# Altium project 05021002.PrjPcb
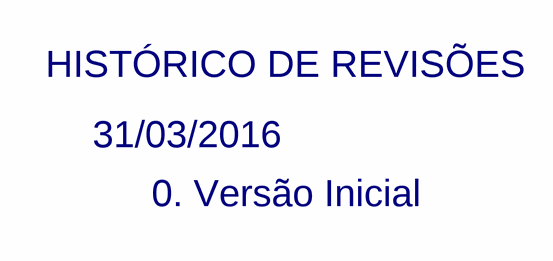
[diagram p0: 05021002_RevisionHistory.SchDoc]
8 sheets, 69 parts. Net scope: global (net labels, ports and power ports of the same name join across sheets).
Board file: 05021002.PcbDoc
Sheets:
  05021002_RevisionHistory.SchDoc
  05021002_Input's.SchDoc
  05021002_GPIO's.SchDoc
  05021002_Serial.SchDoc
  05021002_Analog's.SchDoc
  05021002_PWM - Buzzer and Led.SchDoc
  05021002_Accelerometer.SchDoc
  05021002_7-Segment Display.SchDoc

## Sheet 05021002_RevisionHistory.SchDoc: Ipê Board
size A4; Organization: Cerebra SC; Address1: R. Coriolano José Gilbertone; Address2: Jd. Paulista; Address3: n° 703; Address4: São Carlos - Brasil; DocumentNumber: 1; Revision: A; SheetNumber: 1; SheetTotal: 8

### Notes on the sheet
- HISTÓRICO DE REVISÕES
- 31/03/2016
- 0. Versão Inicial
- Title
- Size:
- Date:
- A4
- Number:
- Time:
- Revision:
- Sheet
- of
- File:

## Sheet 05021002_Input's.SchDoc: Ipê Board
size A4; Organization: Cerebra SC; Address1: R. Coriolano José Gilbertone; Address2: Jd. Paulista; Address3: n° 703; Address4: São Carlos - Brasil; DocumentNumber: 2; Revision: A; SheetNumber: 2; SheetTotal: 8
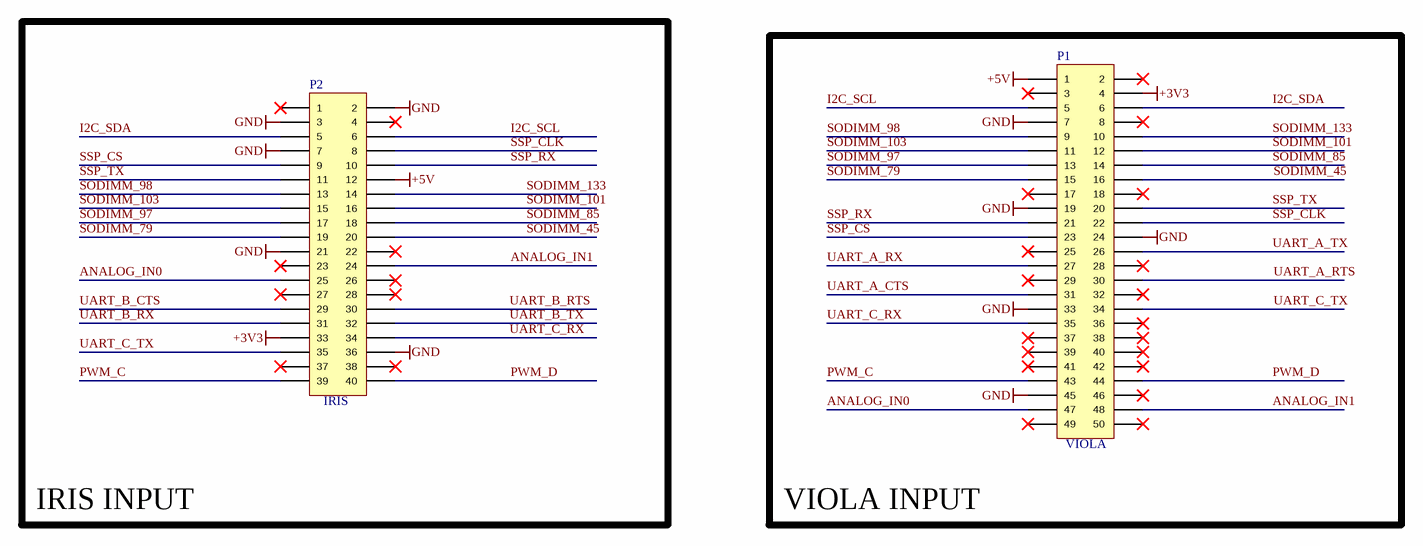
[diagram p1: 05021002_Input's.SchDoc]

### Parts
P1  VIOLA  [HDR2X25]
P2  IRIS  [HDR2X20]

### Blocks framed on the sheet
IRIS INPUT: P2
VIOLA INPUT: P1

### Nets
+3V3: P1.4 P2.33
+5V: P1.1 P2.12
GND: P1.7 P1.19 P1.24 P1.33 P1.45 P2.2 P2.3 P2.7 P2.21 P2.36
ANALOG_IN0: P1.47 P2.25
ANALOG_IN1: P1.48 P2.24
I2C_SCL: P1.5 P2.6
I2C_SDA: P1.6 P2.5
PWM_C: P1.43 P2.39
PWM_D: P1.44 P2.40
SODIMM_45: P1.16 P2.20
SODIMM_79: P1.15 P2.19
SODIMM_85: P1.14 P2.18
SODIMM_97: P1.13 P2.17
SODIMM_98: P1.9 P2.13
SODIMM_101: P1.12 P2.16
SODIMM_103: P1.11 P2.15
SODIMM_133: P1.10 P2.14
SSP_CLK: P1.22 P2.8
SSP_CS: P1.23 P2.9
SSP_RX: P1.21 P2.10
SSP_TX: P1.20 P2.11
UART_A_CTS: P1.31 P2.29  [also labelled UART_B_CTS]
UART_A_RTS: P1.30 P2.30  [also labelled UART_B_RTS]
UART_A_RX: P1.27 P2.31  [also labelled UART_B_RX]
UART_A_TX: P1.26 P2.32  [also labelled UART_B_TX]
UART_C_RX: P1.35 P2.34
UART_C_TX: P1.34 P2.35

Not connected (* = marked no-connect by the designer): P1 2* 3* 8* 17* 18* 25* 28* 29* 32* 36* 37* 38* 39* 40* 41* 42* 46* 49* 50*; P2 1* 4* 22* 23* 26* 27* 28* 37* 38*

### Notes on the sheet
- Title
- Size:
- Date:
- A4
- Number:
- Time:
- Revision:
- Sheet
- of
- File:

### Library data of the parts
P1 = Header 25X2: Header, 25-Pin, Dual row; LatestRevisionDate: 17-Jul-2002; LatestRevisionNote: Re-released for DXP Platform.; Publisher: Altium Limited
P2 = Header 20X2: Header, 20-Pin, Dual row; LatestRevisionDate: 17-Jul-2002; LatestRevisionNote: Re-released for DXP Platform.; Publisher: Altium Limited

## Sheet 05021002_GPIO's.SchDoc: Ipê Board
size A4; Organization: Cerebra SC; Address1: R. Coriolano José Gilbertone; Address2: Jd. Paulista; Address3: n° 703; Address4: São Carlos - Brasil; DocumentNumber: 3; Revision: A; SheetNumber: 3; SheetTotal: 8
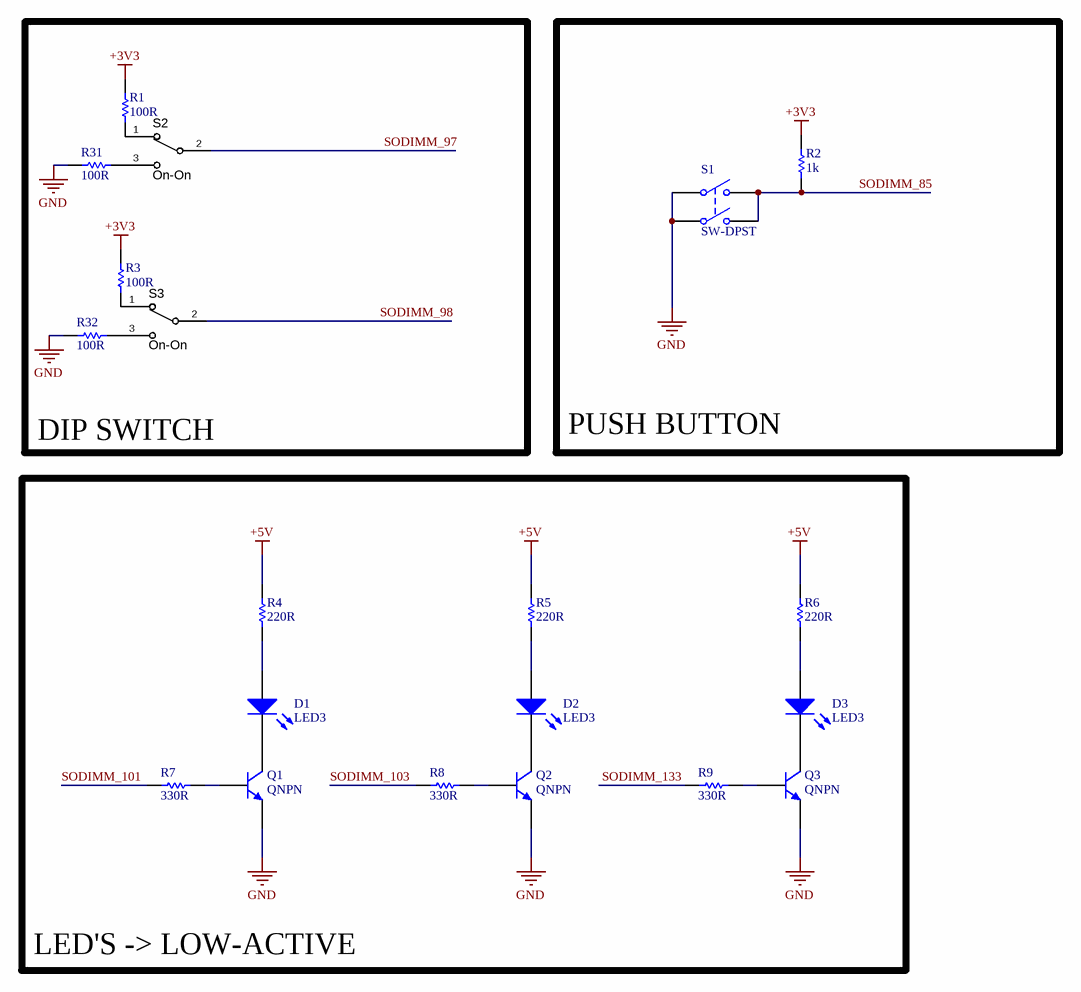
[diagram p2: 05021002_GPIO's.SchDoc]

### Parts
D1  LED3  [LED-0805-K]
D2  LED3  [LED-0805-K]
D3  LED3  [LED-0805-K]
Q1  QNPN  [SOT-23]
Q2  QNPN  [SOT-23]
Q3  QNPN  [SOT-23]
R1  100R  [0805]
R2  1k  [0805]
R3  100R  [0805]
R4  220R  [0805]
R5  220R  [0805]
R6  220R  [0805]
R7  330R  [0805]
R8  330R  [0805]
R9  330R  [0805]
R31  100R  [0805]
R32  100R  [0805]
S1  SW-DPST  [430182080816]
S2  ON-ON  [SWITCH_SPDT_SLIDER]
S3  ON-ON  [SWITCH_SPDT_SLIDER]

### Blocks framed on the sheet
DIP SWITCH: R1 R3 R31 R32 S2 S3
PUSH BUTTON: R2 S1
LED'S -> LOW-ACTIVE: D1-D3 Q1-Q3 R4-R9

### Nets
+3V3: R1.2 R2.2 R3.2
+5V: R4.2 R5.2 R6.2
GND: Q1.3(E) Q2.3(E) Q3.3(E) R31.2 R32.2 S1.1(COMMON1) S1.3(COMMON2)
SODIMM_85: R2.1 S1.2(NO1) S1.4(NO2)
SODIMM_97: S2.2
SODIMM_98: S3.2
SODIMM_101: R7.1
SODIMM_103: R8.1
SODIMM_133: R9.1
NetD1_1: D1.1(A) R4.1
NetD1_2: D1.2(K) Q1.1(C)
NetD2_1: D2.1(A) R5.1
NetD2_2: D2.2(K) Q2.1(C)
NetD3_1: D3.1(A) R6.1
NetD3_2: D3.2(K) Q3.1(C)
NetQ1_2: Q1.2(B) R7.2
NetQ2_2: Q2.2(B) R8.2
NetQ3_2: Q3.2(B) R9.2
NetR1_1: R1.1 S2.1
NetR3_1: R3.1 S3.1
NetR31_1: R31.1 S2.3
NetR32_1: R32.1 S3.3

### Notes on the sheet
- Title
- Size:
- Date:
- A4
- Number:
- Time:
- Revision:
- Sheet
- of
- File:

### Library data of the parts
D1-D3 = LED3: Typical BLUE SiC LED; pin to pad: 1>A 2>K; Part Number 1: LG R971-KN-1; Manufacturer 1: OSRAM Opto Semiconductors Inc.; Published: 8-Jun-2000; LatestRevisionDate: 17-Dec-2003; LatestRevisionNote: PCB Footprint replaced.; DatasheetVersion: 16-Apr-2002; PackageVersion: 16-Apr-2002; PackageReference: 3.5X2.8X1.9; Publisher: Altium Limited; PackageDescription: SM LED; 2 C-Bend Leads; Body 3.5 x 2.8 x 1.9 mm, inc leads (LxWxH typ)
Q1-Q3 = QNPN: NPN Bipolar Transistor; Part Number 1: MMBT2222A-7-F; Manufacturer 1: Diodes Incorporated; Published: 8-Jun-2000; LatestRevisionDate: 29-May-2009; LatestRevisionNote: IPC-7351 Footprint Added.; PackageVersion: Aug-1999; PackageReference: SOT-23B; Publisher: Altium Limited; PackageDescription: 3-Pin SOT-23 Package 0.95 mm Pitch, 2.4 mm Lead Span
R1 R3 R31 R32 = resistor_gen: Part Number 1: RMCF0805JT100R; Manufacturer 1: Stackpole Electronics Inc.; Value: 100R
R2 = resistor_gen: Part Number 1: RC0805JR-071KL; Manufacturer 1: Yageo; Value: 1k
R4-R6 = resistor_gen: Part Number 1: RMCF0805JT220R; Manufacturer 1: Stackpole Electronics Inc.; Value: 220R
R7-R9 = resistor_gen: Part Number 1: RMCF0805JT330R; Manufacturer 1: Stackpole Electronics Inc.; Value: 330R
S1 = SW-DPST: Double-Pole, Single-Throw Switch; Manufacturer 1: Wurth Electronics Inc; Published: 24-Mar-1999; LatestRevisionDate: 17-Jul-2002; LatestRevisionNote: Re-released for DXP Platform.; PackageReference: DPST-4; Publisher: Altium Limited; PackageDescription: Switch; 4 Leads; Part Number 1: 430182080816
S2 S3 = SW_THD_SPDT_On-On: Switch THD vertical toggle SPDT; Manufacturer 1: TE Connectivity; Part Number 1: SLS121PC04; Contact Rating @ Voltage: 0.25A @ 125VAC; SCDType: spec; Circuit: SPDT; Mounting Type: PCB mount; Supplier 1: Digi-Key; Supplier Part Number 1: 450-1598-ND; Switch Function: On-On

## Sheet 05021002_Serial.SchDoc: Ipê Board
size A4; Organization: Cerebra SC; Address1: R. Coriolano José Gilbertone; Address2: Jd. Paulista; Address3: n° 703; Address4: São Carlos - Brasil; DocumentNumber: 4; Revision: A; SheetNumber: 4; SheetTotal: 8
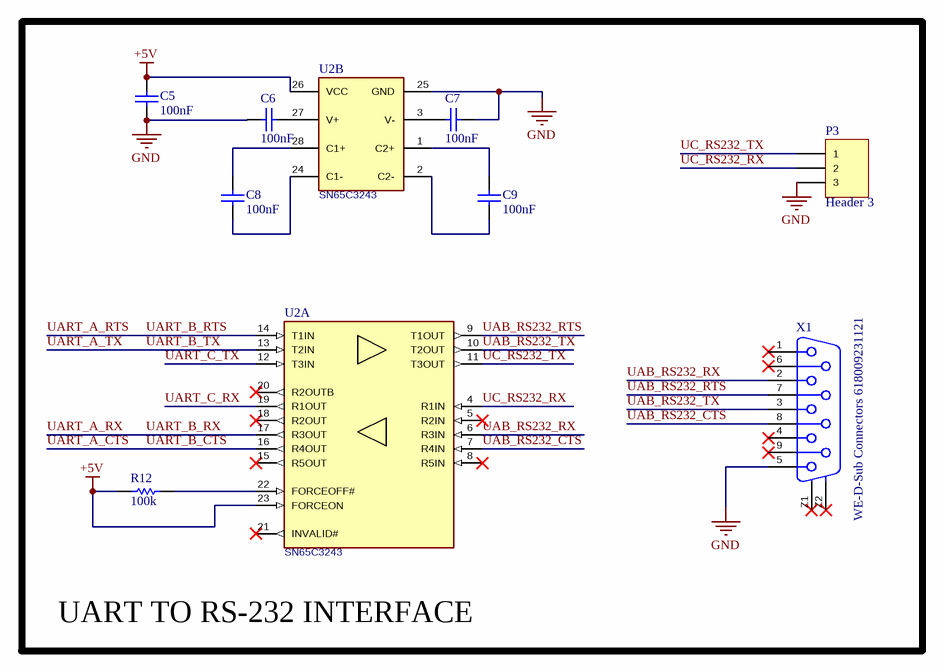
[diagram p3: 05021002_Serial.SchDoc]

### Parts
C5  100nF  [CAPC2012X135N]
C6  100nF  [CAPC2012X135N]
C7  100nF  [CAPC2012X135N]
C8  100nF  [CAPC2012X135N]
C9  100nF  [CAPC2012X135N]
P3  Header 3  [HDR1X3]
R12  100k  [0805]
U2  SN65C3243  [SOP65P780X200-28N]  (parts A,B of 2)
X1  WE-D-Sub Connectors 618009231121  [618009231121]

### Blocks framed on the sheet
UART TO RS-232 INTERFACE: C5-C9 P3 R12 U2 X1

### Nets
+5V: C5.2 R12.1 U2.23(FORCEON) U2.26(VCC)
GND: C5.1 C6.1 C7.2 P3.3 U2.25(GND) X1.5
UAB_RS232_CTS: U2.7(R4IN) X1.8
UAB_RS232_RTS: U2.9(T1OUT) X1.7
UAB_RS232_RX: U2.6(R3IN) X1.2
UAB_RS232_TX: U2.10(T2OUT) X1.3
UART_A_CTS: U2.16(R4OUT)  [also labelled UART_B_CTS]
UART_A_RTS: U2.14(T1IN)  [also labelled UART_B_RTS]
UART_A_RX: U2.17(R3OUT)  [also labelled UART_B_RX]
UART_A_TX: U2.13(T2IN)  [also labelled UART_B_TX]
UART_C_RX: U2.19(R1OUT)
UART_C_TX: U2.12(T3IN)
UC_RS232_RX: P3.2 U2.4(R1IN)
UC_RS232_TX: P3.1 U2.11(T3OUT)
NetC6_2: C6.2 U2.27(V+)
NetC7_1: C7.1 U2.3(V-)
NetC8_1: C8.1 U2.24(C1-)
NetC8_2: C8.2 U2.28(C1+)
NetC9_1: C9.1 U2.2(C2-)
NetC9_2: C9.2 U2.1(C2+)
NetR12_2: R12.2 U2.22(FORCEOFF#)

Not connected (* = marked no-connect by the designer): U2 5(R2IN)* 8(R5IN)* 15(R5OUT)* 18(R2OUT)* 20(R2OUTB)* 21(INVALID#)*; X1 1* 4* 6* 9* Z1(GND)* Z2(GND)*

### Notes on the sheet
- Title
- Size:
- Date:
- A4
- Number:
- Time:
- Revision:
- Sheet
- of
- File:

### Library data of the parts
C5-C9 = capacitor_gen: Generic Capacitor; Part Number 1: 885012207016; Manufacturer 1: Wurth Electronics Inc; Value: 100nF
P3 = Header 3: Header, 3-Pin; LatestRevisionDate: 17-Jul-2002; LatestRevisionNote: Re-released for DXP Platform.; Publisher: Altium Limited
R12 = resistor_gen: Part Number 1: RC0805JR-07100KL; Manufacturer 1: Yageo; Value: 100k
U2 = IC-TI-SN65C3243: RS-232 Serial Transceiver; Manufacturer 1: Texas Instruments; Part Number 1: SN65C3243
X1 = WE-D-Sub Connectors 618009231121: WR-DSUB Female Angled PCB Connector; Manufacturer 1: Wurth Elektronik; ComponentLink1 Description: Manufacturer; ComponentLink2 Description: Datasheet; NoPins: 9; ComponentLink1URL: http://www.we-online.de; ComponentLink2URL: http://katalog.we-online.de/em/datasheet/6180xx231121.pdf; Created by: Karrer Zheng; Created Date: 10/16/2014; Part Number 1: 618009231121

## Sheet 05021002_Analog's.SchDoc: Ipê Board
size A4; Organization: Cerebra SC; Address1: R. Coriolano José Gilbertone; Address2: Jd. Paulista; Address3: n° 703; Address4: São Carlos - Brasil; DocumentNumber: 5; Revision: A; SheetNumber: 5; SheetTotal: 8
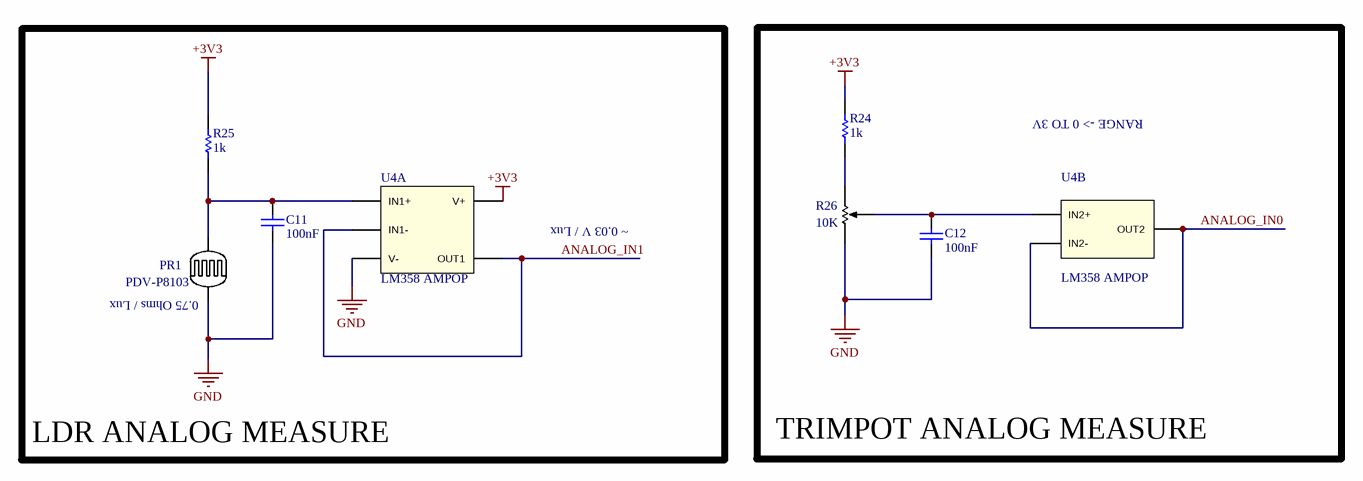
[diagram p4: 05021002_Analog's.SchDoc]

### Parts
C11  100nF  [CAPC2012X135N]
C12  100nF  [CAPC2012X135N]
PR1  PDV-P8103  [PDV-P8103]
R24  1k  [0805]
R25  1k  [0805]
R26  10K  [TC33X-2-103E]
U4  LM358 AMPOP  [SOIC 8]  (parts A,B of 2)

### Blocks framed on the sheet
LDR ANALOG MEASURE: C11 PR1 R25 U4
TRIMPOT ANALOG MEASURE: C12 R24 R26 U4

### Nets
+3V3: R24.2 R25.2 U4.8(V+)
GND: C11.1 C12.1 PR1.2 R26.1(CCW) U4.4(V-)
ANALOG_IN0: U4.6(IN2-) U4.7(OUT2)
ANALOG_IN1: U4.1(OUT1) U4.2(IN1-)
NetC11_2: C11.2 PR1.1 R25.1 U4.3(IN1+)
NetC12_2: C12.2 R26.2(WIPER) U4.5(IN2+)
NetR24_1: R24.1 R26.3(CW)

### Notes on the sheet
- RANGE -> 0 TO 3V
- ~ 0.03 V / Lux
- (near PR1) 0.75 Ohms / Lux
- Title
- Size:
- Date:
- A4
- Number:
- Time:
- Revision:
- Sheet
- of
- File:

### Library data of the parts
C11 C12 = capacitor_gen: as C5 on sheet 05021002_Serial; Value: 100nF
PR1 = PhotoResistor PDV-P8103: Photoconductive photocells designed to sense light from 400 to 700 nm; Manufacturer 1: Luna Optoelectronics; Part Number 1: PDV-P8103
R24 R25 = resistor_gen: as R2 on sheet 05021002_GPIO's; Value: 1k
R26 = Trimmer 10K: 3 mm SMD Trimpot® Trimming Potentiometer; Bourns: Manufacturer 1; Part Number 1: TC33X-2-103E
U4 = LM358: OPERATIONAL AMPLIFIER LM358; Part Number 1: LM358DR; Manufacturer 1: Texas Instruments

## Sheet 05021002_PWM - Buzzer and Led.SchDoc: Ipê Board
size A4; Organization: Cerebra SC; Address1: R. Coriolano José Gilbertone; Address2: Jd. Paulista; Address3: n° 703; Address4: São Carlos - Brasil; DocumentNumber: 6; Revision: A; SheetNumber: 6; SheetTotal: 8
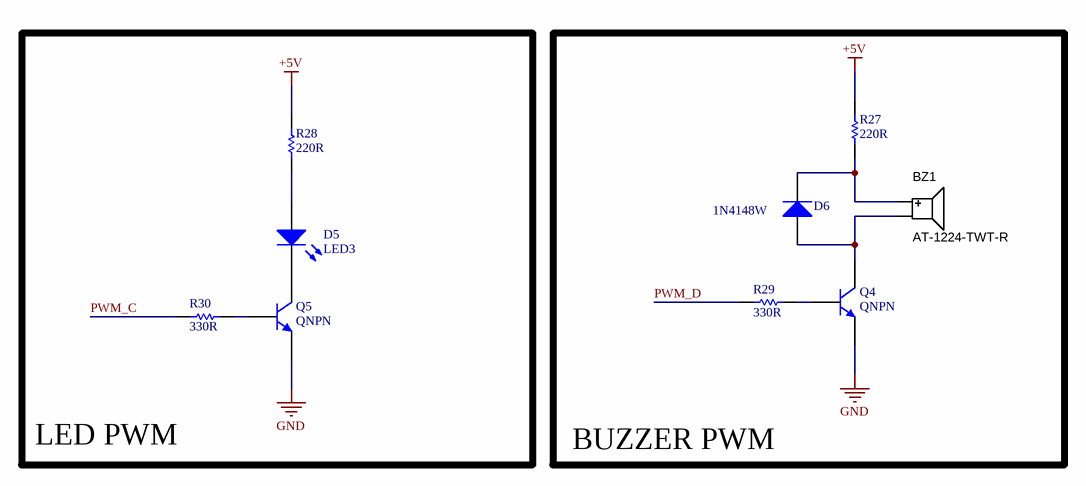
[diagram p5: 05021002_PWM - Buzzer and Led.SchDoc]

### Parts
BZ1  Part Number 1: AT-1224-TWT-R  [BUZZER_12.0X8.5MM]  (hidden comment: 5V BUZZER)
D5  LED3  [LED-0805-K]
D6  1N4148W  [SOD-123]
Q4  QNPN  [SOT-23]
Q5  QNPN  [SOT-23]
R27  220R  [0805]
R28  220R  [0805]
R29  330R  [0805]
R30  330R  [0805]

### Blocks framed on the sheet
LED PWM: D5 Q5 R28 R30
BUZZER PWM: BZ1 D6 Q4 R27 R29

### Nets
+5V: R27.2 R28.2
GND: Q4.3(E) Q5.3(E)
PWM_C: R30.1
PWM_D: R29.1
NetBZ1_1: BZ1.1(Positive) D6.1(K) R27.1
NetBZ1_2: BZ1.2(Negative) D6.2(A) Q4.1(C)
NetD5_1: D5.1(A) R28.1
NetD5_2: D5.2(K) Q5.1(C)
NetQ4_2: Q4.2(B) R29.2
NetQ5_2: Q5.2(B) R30.2

### Notes on the sheet
- Title
- Size:
- Date:
- A4
- Number:
- Time:
- Revision:
- Sheet
- of
- File:

### Library data of the parts
BZ1 = BZ_12x8.5x6.5_2kHz: Speaker, Magnetic Transducer; Manufacturer 1: PUI Audio; SCDType: source; Package / Case: 6.5mm pitch
D5 = LED3: Typical BLUE SiC LED; pin to pad: 1>A 2>K; Manufacturer 1: OSRAM Opto Semiconductors Inc.; Part Number 1: LG R971-KN-1; Published: 8-Jun-2000; LatestRevisionDate: 17-Dec-2003; LatestRevisionNote: PCB Footprint replaced.; DatasheetVersion: 16-Apr-2002; PackageVersion: 16-Apr-2002; PackageReference: 3.5X2.8X1.9; Publisher: Altium Limited; PackageDescription: SM LED; 2 C-Bend Leads; Body 3.5 x 2.8 x 1.9 mm, inc leads (LxWxH typ)
D6 = 1N4148W: Small Signal Fast Switching Diode; Part Number 1: 1N4148W-TP; Manufacturer 1: Micro Commercial Co
Q4 Q5 = QNPN: as Q1 on sheet 05021002_GPIO's; Published: 8-Jun-2000; LatestRevisionDate: 29-May-2009; LatestRevisionNote: IPC-7351 Footprint Added.; PackageVersion: Aug-1999; PackageReference: SOT-23B; Publisher: Altium Limited; PackageDescription: 3-Pin SOT-23 Package 0.95 mm Pitch, 2.4 mm Lead Span
R27 R28 = resistor_gen: as R4 on sheet 05021002_GPIO's; Value: 220R
R29 R30 = resistor_gen: as R7 on sheet 05021002_GPIO's; Value: 330R

## Sheet 05021002_Accelerometer.SchDoc: Ipê Board
size A4; Organization: Cerebra SC; Address1: R. Coriolano José Gilbertone; Address2: Jd. Paulista; Address3: n° 703; Address4: São Carlos - Brasil; DocumentNumber: 7; Revision: A; SheetNumber: 7; SheetTotal: 8
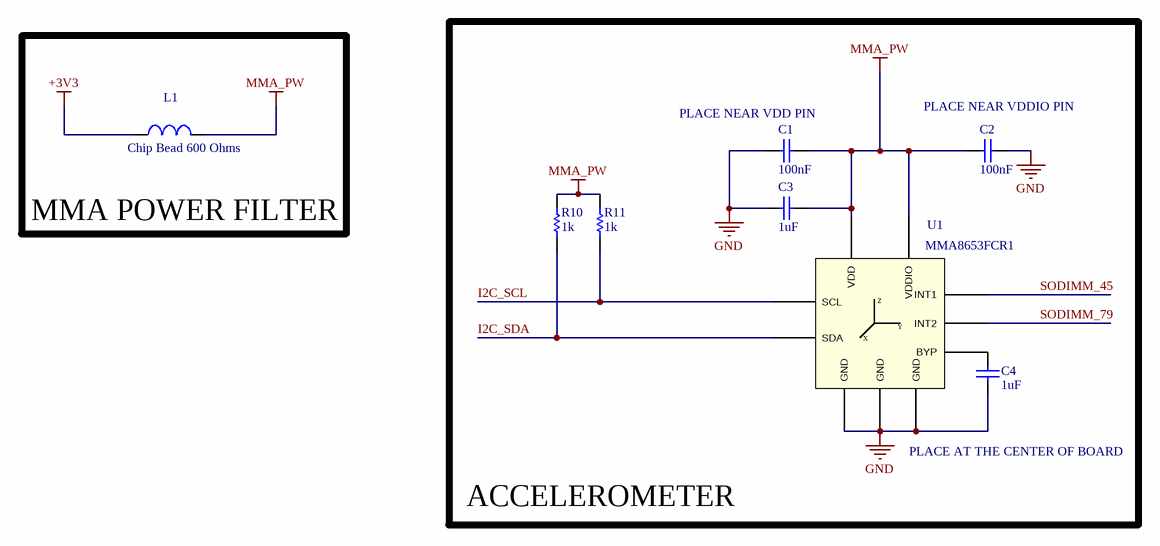
[diagram p6: 05021002_Accelerometer.SchDoc]

### Parts
C1  100nF  [CAPC2012X135N]
C2  100nF  [CAPC2012X135N]
C3  1uF  [CAPC2012X135N]
C4  1uF  [CAPC2012X135N]
L1  Chip Bead 600 Ohms  [1608[0603]]
R10  1k  [0805]
R11  1k  [0805]
U1  MMA8653FCR1  [MMA8653F]

### Blocks framed on the sheet
ACCELEROMETER: C1-C4 R10 R11 U1
MMA POWER FILTER: L1

### Nets
+3V3: L1.1
GND: C1.1 C2.2 C3.1 C4.1 U1.6(GND) U1.7(GND) U1.9(GND)
MMA_PW: C1.2 C2.1 C3.2 L1.2 R10.2 R11.2 U1.1(VDD) U1.8(VDDIO)
I2C_SCL: R11.1 U1.2(SCL)
I2C_SDA: R10.1 U1.10(SDA)
SODIMM_45: U1.3(INT1)
SODIMM_79: U1.5(INT2)
NetC4_2: C4.2 U1.4(BYP)

### Notes on the sheet
- (near C1) PLACE NEAR VDD PIN
- (near C2) PLACE NEAR VDDIO PIN
- PLACE AT THE CENTER OF BOARD
- Title
- Size:
- Date:
- A4
- Number:
- Time:
- Revision:
- Sheet
- of
- File:
- (in symbol MMA8653FCR1) Z; Y; X

### Library data of the parts
C1 C2 = capacitor_gen: as C5 on sheet 05021002_Serial; Value: 100nF
C3 C4 = capacitor_gen: Generic Capacitor; Part Number 1: 0805ZC105KAT2A; Manufacturer 1: AVX Corporation; Value: 1uF
L1 = L: Wide Band Bead 600 Ohms - Rdc 0.45 mOhms 74279265; Manufacturer 1: Wurth Electronics Inc; Value: 600 Ohms; Part Number 1: 742 792 65
R10 R11 = resistor_gen: as R2 on sheet 05021002_GPIO's; Value: 1k
U1 = MMA8653FCR1: Manufacturer 1: Freescale Semiconductor - NXP; Part Number 1: MMA8653FCR1

## Sheet 05021002_7-Segment Display.SchDoc: Ipê Board
size A4; Organization: Cerebra SC; Address1: R. Coriolano José Gilbertone; Address2: Jd. Paulista; Address3: n° 703; Address4: São Carlos - Brasil; DocumentNumber: 8; Revision: A; SheetNumber: 8; SheetTotal: 8
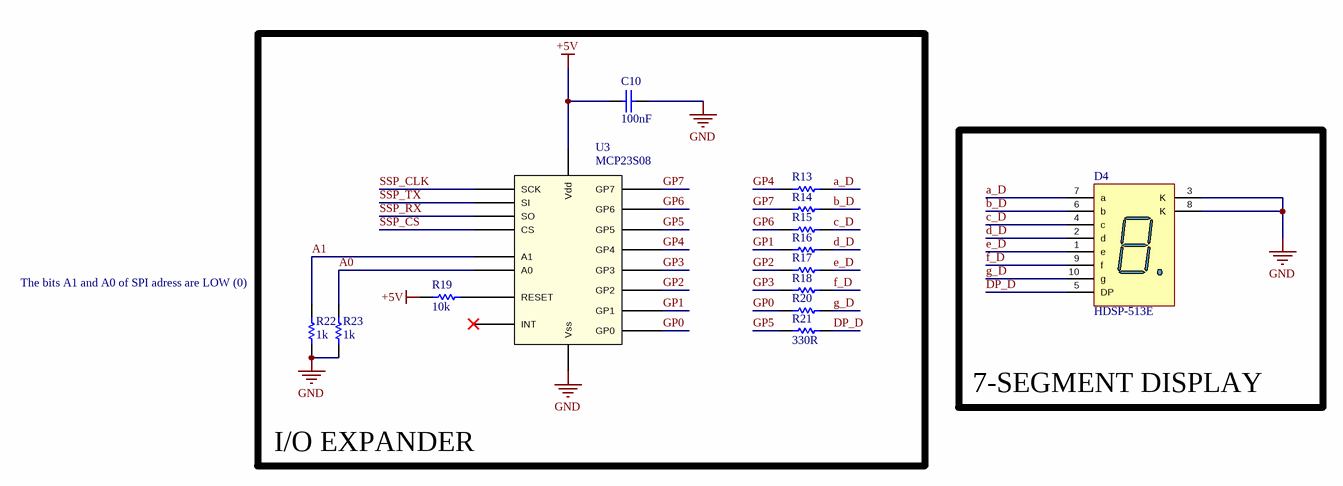
[diagram p7: 05021002_7-Segment Display.SchDoc]

### Parts
C10  100nF  [CAPC2012X135N]
D4  HDSP-513E  [HDSP-513E]
R13  330R  [0805]  (value not drawn)
R14  330R  [0805]  (value not drawn)
R15  330R  [0805]  (value not drawn)
R16  330R  [0805]  (value not drawn)
R17  330R  [0805]  (value not drawn)
R18  330R  [0805]  (value not drawn)
R19  10k  [0805]
R20  330R  [0805]  (value not drawn)
R21  330R  [0805]
R22  1k  [0805]
R23  1k  [0805]
U3  MCP23S08  [SSOP20]

### Blocks framed on the sheet
I/O EXPANDER: C10 R13-R23 U3
7-SEGMENT DISPLAY: D4

### Nets
+5V: C10.1 R19.2 U3.20(Vdd)
GND: C10.2 D4.3(K) D4.8(K) R22.1 R23.1 U3.9(Vss)
A0: R23.2 U3.5(A0)
A1: R22.2 U3.4(A1)
a_D: D4.7(a) R13.2
b_D: D4.6(b) R14.2
c_D: D4.4(c) R15.2
d_D: D4.2(d) R16.2
DP_D: D4.5(DP) R21.2
e_D: D4.1(e) R17.2
f_D: D4.9(f) R18.2
g_D: D4.10(g) R20.2
GP0: R20.1 U3.12(GP0)
GP1: R16.1 U3.13(GP1)
GP2: R17.1 U3.14(GP2)
GP3: R18.1 U3.15(GP3)
GP4: R13.1 U3.16(GP4)
GP5: R21.1 U3.17(GP5)
GP6: R15.1 U3.18(GP6)
GP7: R14.1 U3.19(GP7)
SSP_CLK: U3.1(SCK)
SSP_CS: U3.7(CS)
SSP_RX: U3.3(SO)
SSP_TX: U3.2(SI)
NetR19_1: R19.1 U3.6(RESET)

Not connected (* = marked no-connect by the designer): U3 8(INT)*

### Notes on the sheet
- The bits A1 and A0 of SPI adress are LOW (0)
- Title
- Size:
- Date:
- A4
- Number:
- Time:
- Revision:
- Sheet
- of
- File:

### Library data of the parts
C10 = capacitor_gen: as C5 on sheet 05021002_Serial; Value: 100nF
D4 = HDSP-513E: 14.22 mm (0.56 inch) Single Digit General Purpose Seven Segment Display; Manufacturer 1: Avago Technologies; Part Number 1: HDSP-513E
R13-R18 R20 R21 = resistor_gen: as R7 on sheet 05021002_GPIO's; Value: 330R
R19 = resistor_gen: Part Number 1: RMCF0805JT10K0; Manufacturer 1: Stackpole Electronics Inc.; Value: 10k
R22 R23 = resistor_gen: as R2 on sheet 05021002_GPIO's; Value: 1k
U3 = MCP23S08: 8-Bit I/O Expander with Serial Interface; Manufacturer 1: Microchip Technology; Part Number 1: MCP23S08

## Nets that join several sheets
+3V3: 05021002_Input's (P1.4 P2.33), 05021002_GPIO's (R1.2 R2.2 R3.2), 05021002_Analog's (R24.2 R25.2 U4.8), 05021002_Accelerometer (L1.1)
+5V: 05021002_Input's (P1.1 P2.12), 05021002_GPIO's (R4.2 R5.2 R6.2), 05021002_Serial (C5.2 R12.1 U2.23 U2.26), 05021002_PWM - Buzzer and Led (R27.2 R28.2), 05021002_7-Segment Display (C10.1 R19.2 U3.20)
GND: 05021002_Input's (10 pins), 05021002_GPIO's (7 pins), 05021002_Serial (6 pins), 05021002_Analog's (5 pins), 05021002_PWM - Buzzer and Led (Q4.3 Q5.3), 05021002_Accelerometer (7 pins), 05021002_7-Segment Display (6 pins)
ANALOG_IN0: 05021002_Input's (P1.47 P2.25), 05021002_Analog's (U4.6 U4.7)
ANALOG_IN1: 05021002_Input's (P1.48 P2.24), 05021002_Analog's (U4.1 U4.2)
I2C_SCL: 05021002_Input's (P1.5 P2.6), 05021002_Accelerometer (R11.1 U1.2)
I2C_SDA: 05021002_Input's (P1.6 P2.5), 05021002_Accelerometer (R10.1 U1.10)
PWM_C: 05021002_Input's (P1.43 P2.39), 05021002_PWM - Buzzer and Led (R30.1)
PWM_D: 05021002_Input's (P1.44 P2.40), 05021002_PWM - Buzzer and Led (R29.1)
SODIMM_45: 05021002_Input's (P1.16 P2.20), 05021002_Accelerometer (U1.3)
SODIMM_79: 05021002_Input's (P1.15 P2.19), 05021002_Accelerometer (U1.5)
SODIMM_85: 05021002_Input's (P1.14 P2.18), 05021002_GPIO's (R2.1 S1.2 S1.4)
SODIMM_97: 05021002_Input's (P1.13 P2.17), 05021002_GPIO's (S2.2)
SODIMM_98: 05021002_Input's (P1.9 P2.13), 05021002_GPIO's (S3.2)
SODIMM_101: 05021002_Input's (P1.12 P2.16), 05021002_GPIO's (R7.1)
SODIMM_103: 05021002_Input's (P1.11 P2.15), 05021002_GPIO's (R8.1)
SODIMM_133: 05021002_Input's (P1.10 P2.14), 05021002_GPIO's (R9.1)
SSP_CLK: 05021002_Input's (P1.22 P2.8), 05021002_7-Segment Display (U3.1)
SSP_CS: 05021002_Input's (P1.23 P2.9), 05021002_7-Segment Display (U3.7)
SSP_RX: 05021002_Input's (P1.21 P2.10), 05021002_7-Segment Display (U3.3)
SSP_TX: 05021002_Input's (P1.20 P2.11), 05021002_7-Segment Display (U3.2)
UART_A_CTS: 05021002_Input's (P1.31 P2.29), 05021002_Serial (U2.16)
UART_A_RTS: 05021002_Input's (P1.30 P2.30), 05021002_Serial (U2.14)
UART_A_RX: 05021002_Input's (P1.27 P2.31), 05021002_Serial (U2.17)
UART_A_TX: 05021002_Input's (P1.26 P2.32), 05021002_Serial (U2.13)
UART_C_RX: 05021002_Input's (P1.35 P2.34), 05021002_Serial (U2.19)
UART_C_TX: 05021002_Input's (P1.34 P2.35), 05021002_Serial (U2.12)